# Altium project myPLC.PrjPcb
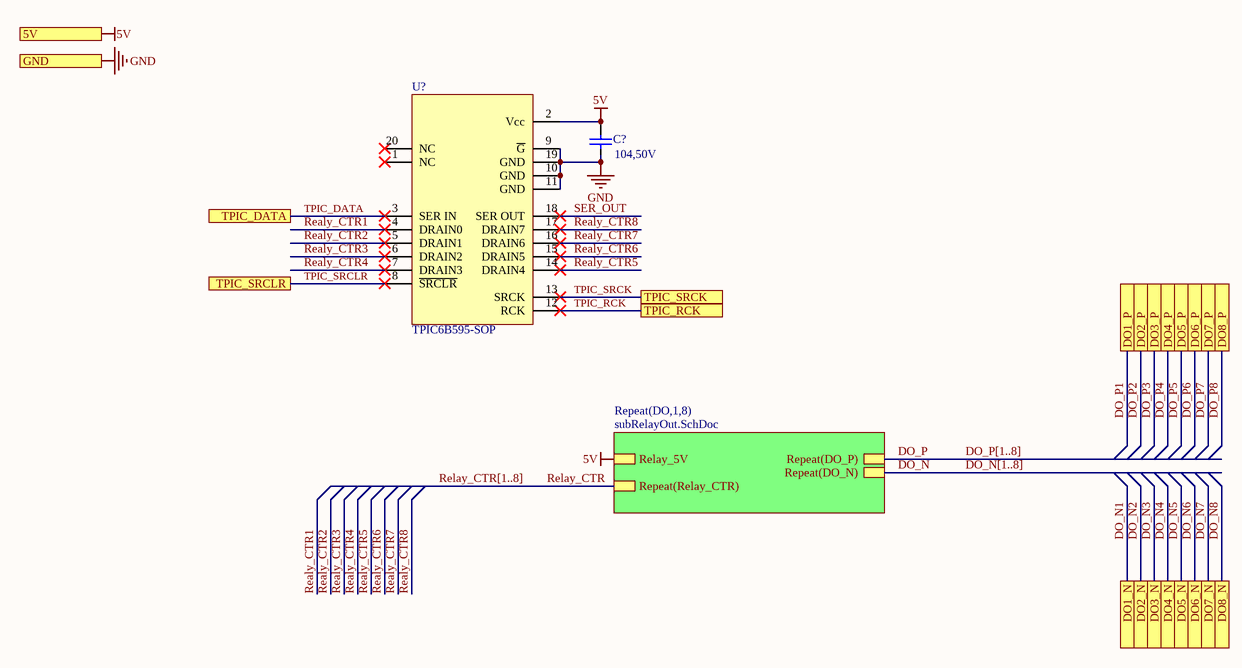
[diagram p0: relayOut.SchDoc]
1 sheet, 2 parts. Net scope: hierarchical (ports join the sheet entries above them; power ports are global).
Board file: PCB1.PcbDoc

## Sheet relayOut.SchDoc
size A4

### Parts
C48  104,50V  [C0805 - 1]
U13  TPIC6B595-SOP  [TPIC6B595]

### Sub-sheets
Repeat(DO,1,8) = subRelayOut.SchDoc (file not in this document): Repeat(DO_P), Repeat(DO_N), Relay_5V, Repeat(Relay_CTR)

### Ports
5V, DO1_N, DO1_P, DO2_N, DO2_P, DO3_N, DO3_P, DO4_N, DO4_P, DO5_N, DO5_P, DO6_N, DO6_P, DO7_N, DO7_P, DO8_N, DO8_P, GND, TPIC_DATA, TPIC_RCK, TPIC_SRCK, TPIC_SRCLR

### Nets
5V: C48.2 U13.2(Vcc) ; port 5V, sheet Repeat(DO,1,8)/Relay_5V
GND: C48.1 U13.9(~{G}) U13.10(GND) U13.11(GND) U13.19(GND) ; port GND
Realy_CTR1: U13.4(DRAIN0)
Realy_CTR2: U13.5(DRAIN1)
Realy_CTR3: U13.6(DRAIN2)
Realy_CTR4: U13.7(DRAIN3)
Realy_CTR5: U13.14(DRAIN4)
Realy_CTR6: U13.15(DRAIN5)
Realy_CTR7: U13.16(DRAIN6)
Realy_CTR8: U13.17(DRAIN7)
SER_OUT: U13.18(SER_OUT)
TPIC_DATA: U13.3(SER_IN) ; port TPIC_DATA
TPIC_RCK: U13.12(RCK) ; port TPIC_RCK
TPIC_SRCK: U13.13(SRCK) ; port TPIC_SRCK
TPIC_SRCLR: U13.8(~{SRCLR}) ; port TPIC_SRCLR

Not connected (* = marked no-connect by the designer): U13 1(NC)* 20(NC)*

### Buses and harness runs
bus DO_N[1..8]
bus DO_P[1..8]
bus Relay_CTR[1..8]

### Library data of the parts
C48 = 无极电容: Value: 104, 16V; Type: 贴片电容
U13 = TPIC6B595: name: 集成模块（SMD）

## Assembly variants
Variant of myPLC: alternate parts J1 -> DS1034-09FUNSi44